# Altium schematic sheet Sheet.SchDoc: Sheet Title - Edit in Document Options
size Tabloid; DrawnBy: THIS IS IGNORED; Engineer: THIS IS IGNORED; Organization: NCAR Earth Observing Laboratory; Revision: THIS IS IGNORED, SEE THE PROJECT PARAMETERS; SheetNumber: 1; SheetTotal: THIS IS IGNORED, SEE THE PROJECT PARAMETERS; PCB Name: THIS IS IGNORED, SEE THE PROJECT PARAMETERS
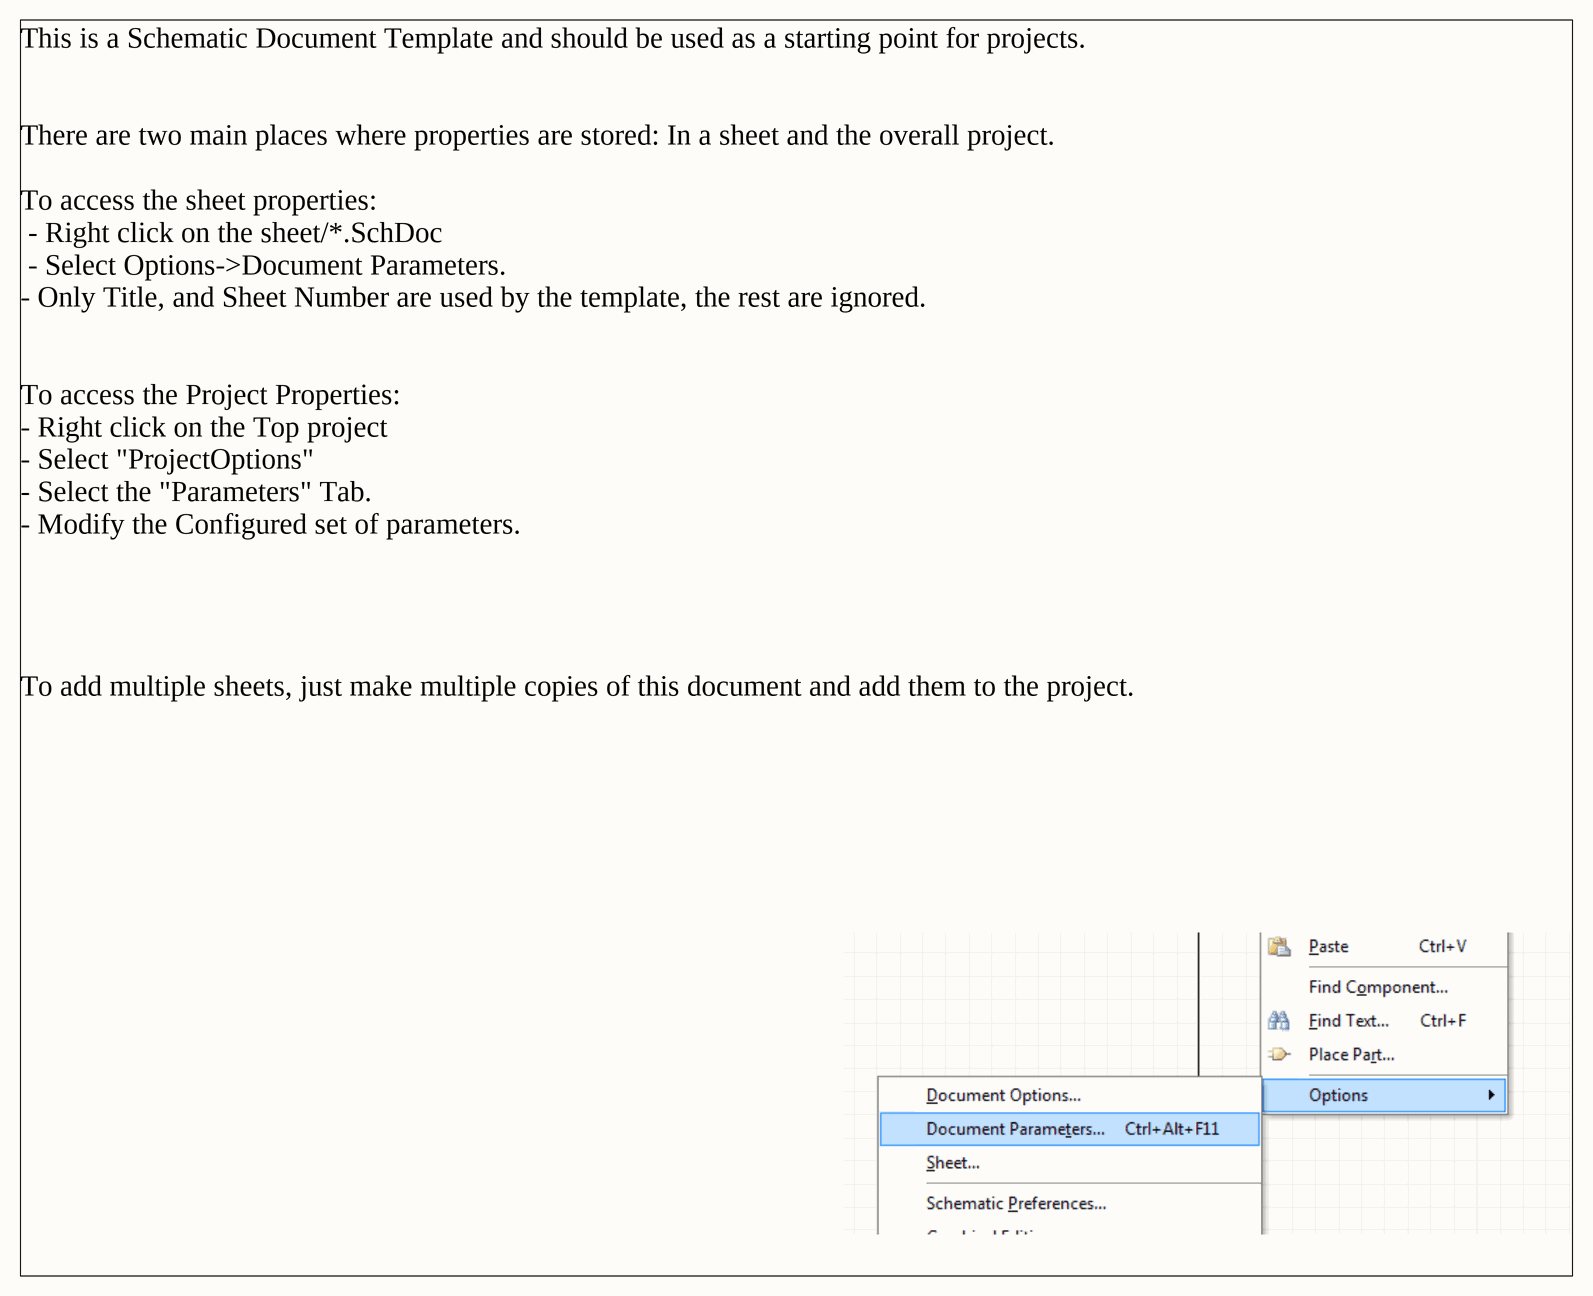
[diagram p0: Sheet.SchDoc]

## Notes on the sheet
- This is a Schematic Document Template and should be used as a starting point for projects.
  There are two main places where properties are stored: In a sheet and the overall project.
  To access the sheet properties:
  - Right click on the sheet/*.SchDoc
  - Select Options->Document Parameters.
  - Only Title, and Sheet Number are used by the template, the rest are ignored.
  To access the Project Properties:
  - Right click on the Top project
  - Select "ProjectOptions"
  - Select the "Parameters" Tab.
  - Modify the Configured set of parameters.
  To add multiple sheets, just make multiple copies of this document and add them to the project.
- Sheet Title
- Insitu Sensing Facility
  Boulder, Co USA
- Copyright 2008-2015 University Corporation for Atmospheric Research. All rights reserved.
  The US Government is authorized full use of this information for U.S. Government purposes.
  CONFIDENTIAL. Any unauthorized use, copying, or distribution is prohibited.
- Date:
- Size
- B
- Project / Part Number
- SVN:
- Sheet
- of
- Revision
- File:
- Drawn By: